# Altium schematic sheet heater_control.SchDoc
size A4; DocumentNumber: 4; SheetNumber: 4; SheetTotal: 11
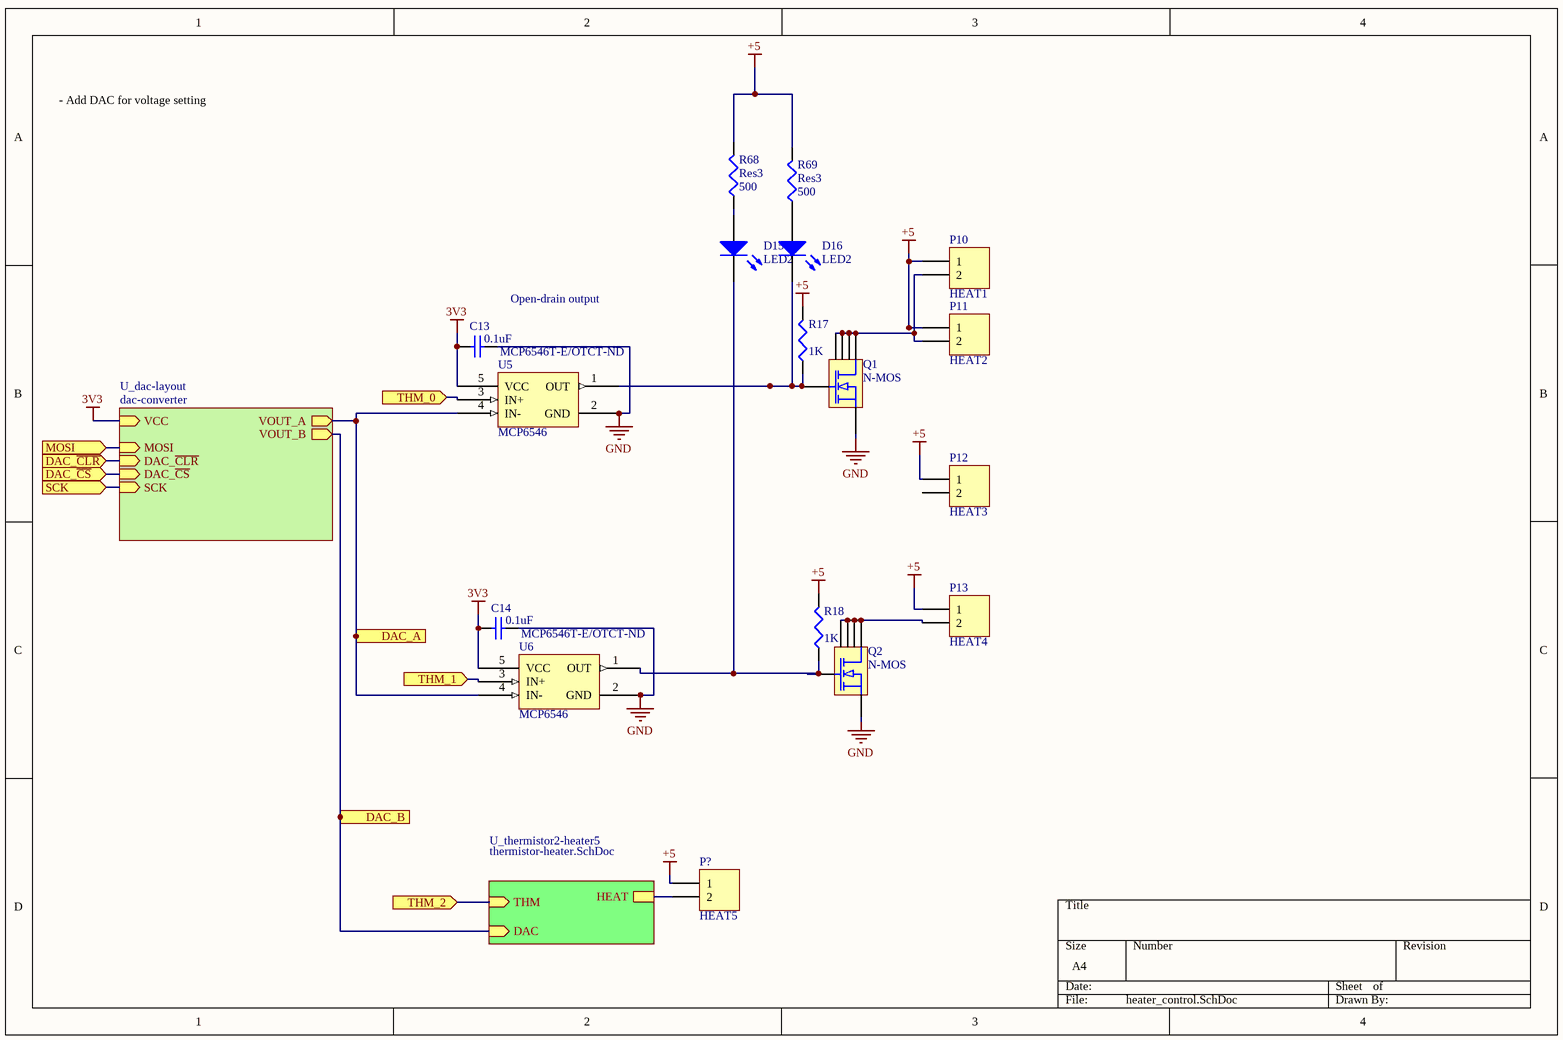
[diagram p0: heater_control.SchDoc]

## Parts
C13  0.1uF  [1608[0603]]
C14  0.1uF  [1608[0603]]
D15  LED2  [0603-LED]
D16  LED2  [0603-LED]
P10  HEAT1  [DF14-2P-1.25H(55)]
P11  HEAT2  [DF14-2P-1.25H(55)]
P12  HEAT3  [DF14-2P-1.25H(55)]
P13  HEAT4  [DF14-2P-1.25H(55)]
P?  HEAT5  [DF14-2P-1.25H(55)]
Q1  N-MOS  [SOT23-6_N]
Q2  N-MOS  [SOT23-6_N]
R17  1K  [J1-0603]
R18  1K  [J1-0603]
R68  Res3  value 500  [J1-0603]
R69  Res3  value 500  [J1-0603]
U5  MCP6546  Supplier Part Number 1: MCP6546T-E/OTCT-ND  [SOT-23-5_95P290X160-5N]
U6  MCP6546  Supplier Part Number 1: MCP6546T-E/OTCT-ND  [SOT-23-5_95P290X160-5N]

## Sub-sheets
U_dac-layout = dac-converter: VOUT_A (out), VOUT_B (out), DAC_~{CS} (in), SCK (in), MOSI (in), DAC_~{CLR} (in), VCC (in)
U_thermistor2-heater5 = thermistor-heater.SchDoc: THM (in), DAC (in), HEAT

## Ports
DAC_A (out), DAC_B (out), DAC_~{CLR} (in), DAC_~{CS} (in), MOSI (in), SCK (in), THM_0 (in), THM_1 (in), THM_2 (in)

## Nets
3V3: C13.1 C14.1 U5.5(VCC) U6.5(VCC) ; sheet U_dac-layout/VCC
+5: P10.1 P11.1 P12.1 P13.1 P?.1 R17.2 R18.2 R68.2 R69.2
GND: C13.2 C14.2 Q1.4(S) Q2.4(S) U5.2(GND) U6.2(GND)
DAC_A: U5.4(IN-) U6.4(IN-) ; port DAC_A, sheet U_dac-layout/VOUT_A
DAC_B: port DAC_B, sheet U_dac-layout/VOUT_B, sheet U_thermistor2-heater5/DAC
DAC_~{CLR}: port DAC_~{CLR}, sheet U_dac-layout/DAC_~{CLR}
DAC_~{CS}: port DAC_~{CS}, sheet U_dac-layout/DAC_~{CS}
MOSI: port MOSI, sheet U_dac-layout/MOSI
SCK: port SCK, sheet U_dac-layout/SCK
THM_0: U5.3(IN+) ; port THM_0
THM_1: U6.3(IN+) ; port THM_1
THM_2: port THM_2, sheet U_thermistor2-heater5/THM
NetD15_1: D15.1(A) R68.1
NetD15_2: D15.2(K) Q2.3(G) R18.1 U6.1(OUT)
NetD16_1: D16.1(A) R69.1
NetD16_2: D16.2(K) Q1.3(G) R17.1 U5.1(OUT)
NetP10_2: P10.2 P11.2 Q1.1(D) Q1.2(D) Q1.5(D) Q1.6(D)
NetP13_2: P13.2 Q2.1(D) Q2.2(D) Q2.5(D) Q2.6(D)
NetP?_2: P?.2 ; sheet U_thermistor2-heater5/HEAT

Not connected (* = marked no-connect by the designer): P12 2

## Notes on the sheet
- - Add DAC for voltage setting
- When THM below reference (cold), output is high impedance and MOSFET is ON
  When THM above reference (hot) output is connected to GND and MOSFET is OFF
- (near C13) Open-drain output
- MOSFET ON connects the heaters to GND, which turns them ON

## Library data of the parts
C13 C14 = Cap Semi: Capacitor (Semiconductor SIM Model); Published: 8-Jun-2000; LatestRevisionDate: 29-May-2009; LatestRevisionNote: IPC-7351 Footprint Added.; PackageReference: C1206; Publisher: Altium Limited; PackageDescription: Chip Capacitor; Value: 0.1uF; Supplier: Digi-Key; Supplier Part Number: 311-1341-1-ND; Supplier 1: Digi-Key
D15 D16 = LED2: Typical RED, GREEN, YELLOW, AMBER GaAs LED; Published: 8-Jun-2000; LatestRevisionDate: 17-Jul-2002; LatestRevisionNote: Re-released for DXP Platform.; PackageVersion: Feb-2002; PackageReference: 3.2X1.6X1.1; Publisher: Altium Limited; PackageDescription: SM LED; 2 Flat Leads; Supplier 1: Digi-Key; Supplier: Digi-Key
P10-P13 P? = Header 2: Header, 2-Pin; LatestRevisionDate: 17-Jul-2002; LatestRevisionNote: Re-released for DXP Platform.; Publisher: Altium Limited; Supplier: Digi-Key; Supplier 1: Digi-Key; Supplier Part Number: H10337CT-ND
Q1 Q2 = FDC637BNZCT-ND: N-MOS, low gate ON voltage; Supplier: Digi-Key; Supplier Part Number: FDC637BNZCT-ND; Supplier 1: Digi-Key
R17 R18 R68 R69 = Res3: Resistor; Published: 8-Jun-2000; LatestRevisionDate: 29-May-2009; LatestRevisionNote: IPC-7351 Footprint Added.; PackageReference: J1-0603; Publisher: Altium Limited; PackageDescription: Chip Resistor; Supplier: Digi-Key; Supplier 1: Digi-Key
  R17 R18: Value: 1K; Supplier Part Number: RNCP0603FTD1K00CT-ND
  R68 R69: Supplier Part Number: RMCF0603JT510RCT-ND
U5 U6 = MCP6546: Open-drain output sub-microamp comparator.; Supplier 1: Digi-Key; Supplier: Digi-Key; Supplier Part Number: MCP6546T-E/OTCT-ND